# EAGLE design RingShield (EAGLE 9.6.2)
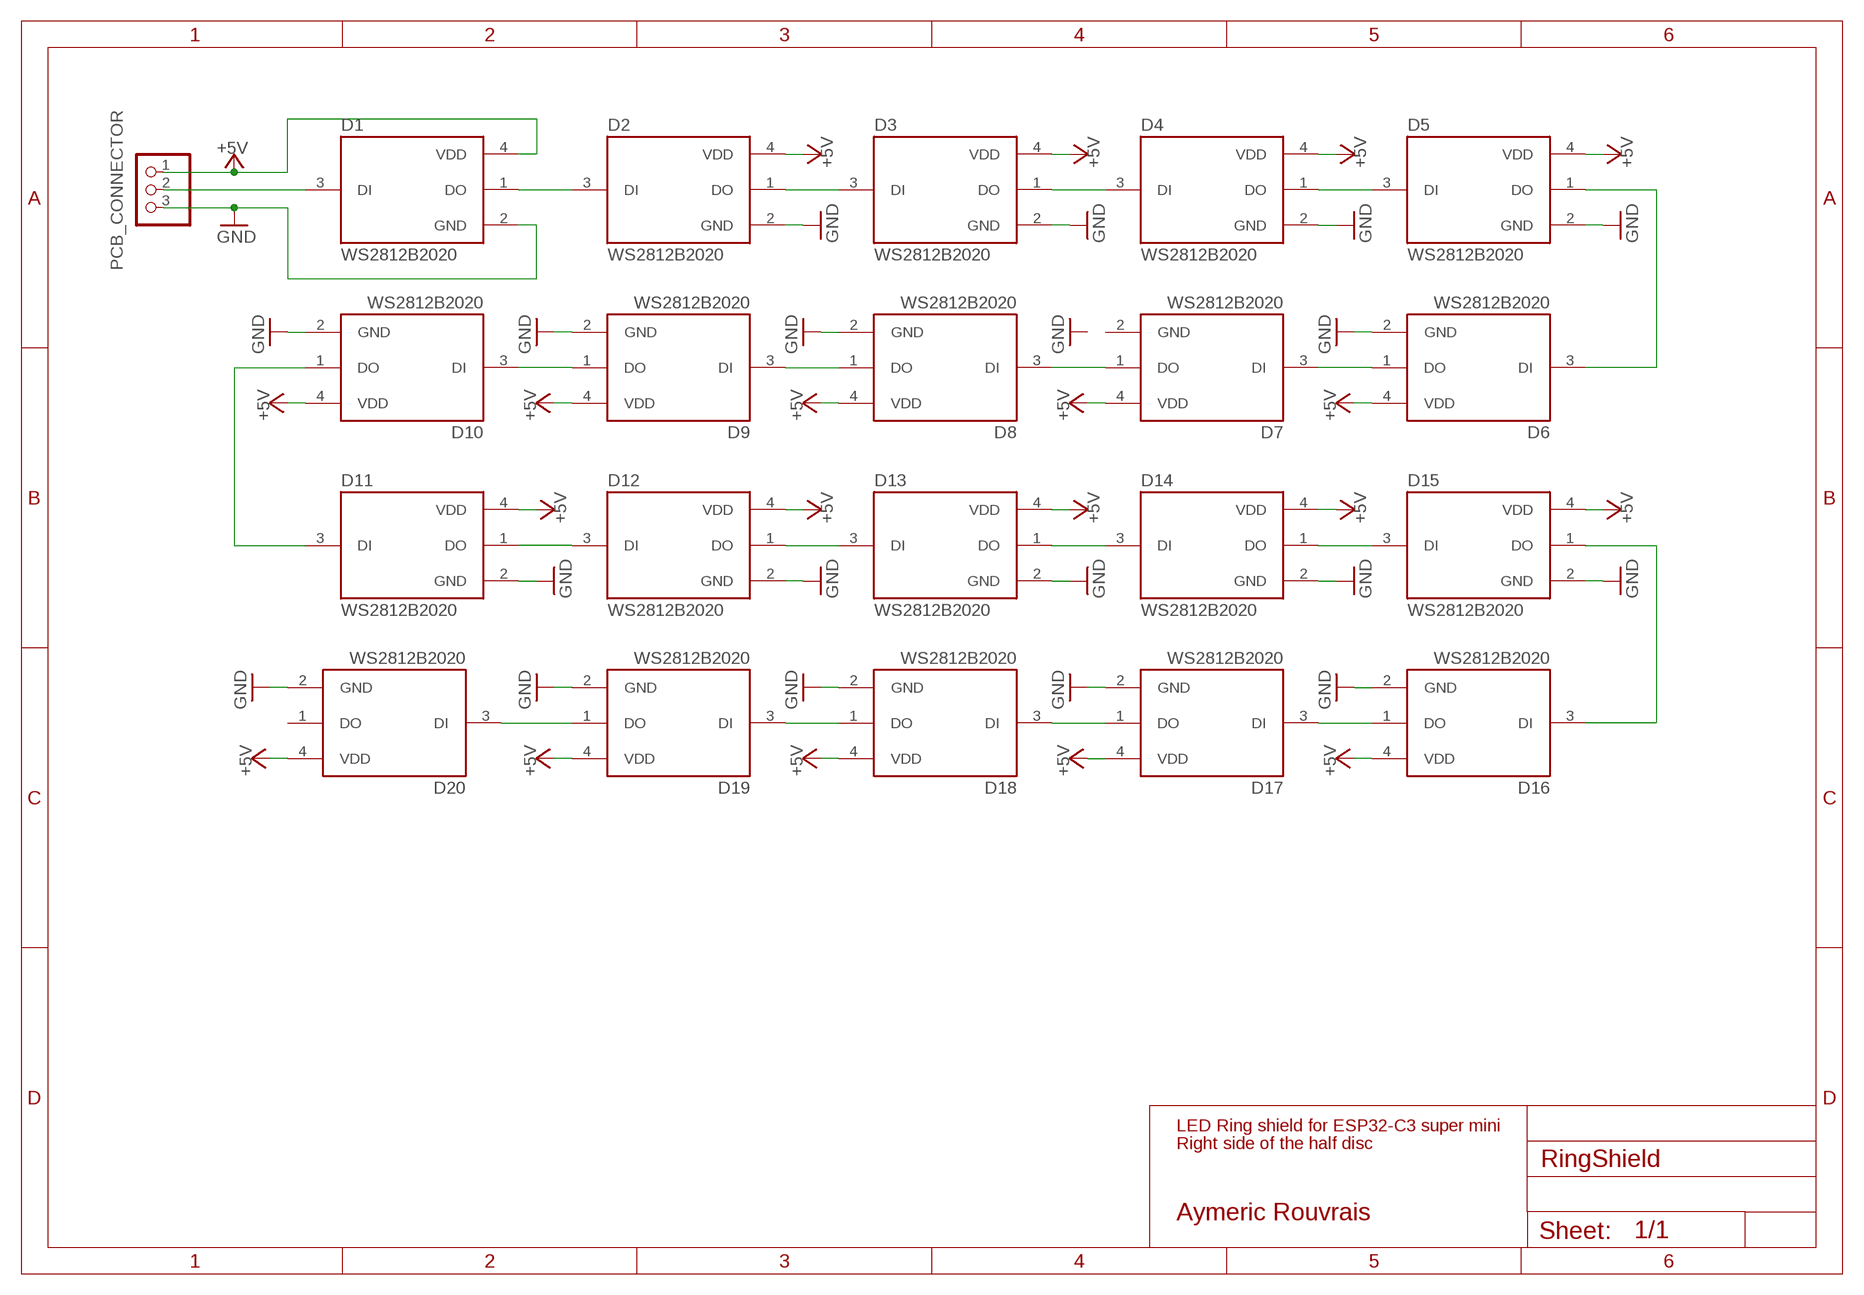
[diagram p0: schematic, sheet 1]

## Parts
D1  WS2812B2020  [LED_WS2812B2020]
D2  WS2812B2020  [LED_WS2812B2020]
D3  WS2812B2020  [LED_WS2812B2020]
D4  WS2812B2020  [LED_WS2812B2020]
D5  WS2812B2020  [LED_WS2812B2020]
D6  WS2812B2020  [LED_WS2812B2020]
D7  WS2812B2020  [LED_WS2812B2020]
D8  WS2812B2020  [LED_WS2812B2020]
D9  WS2812B2020  [LED_WS2812B2020]
D10  WS2812B2020  [LED_WS2812B2020]
D11  WS2812B2020  [LED_WS2812B2020]
D12  WS2812B2020  [LED_WS2812B2020]
D13  WS2812B2020  [LED_WS2812B2020]
D14  WS2812B2020  [LED_WS2812B2020]
D15  WS2812B2020  [LED_WS2812B2020]
D16  WS2812B2020  [LED_WS2812B2020]
D17  WS2812B2020  [LED_WS2812B2020]
D18  WS2812B2020  [LED_WS2812B2020]
D19  WS2812B2020  [LED_WS2812B2020]
D20  WS2812B2020  [LED_WS2812B2020]
PCB_CONNECTOR  PINHD-1X3/90  [1X03/90]

## Nets
+5V: D1.4(VDD) D2.4(VDD) D3.4(VDD) D4.4(VDD) D5.4(VDD) D6.4(VDD) D7.4(VDD) D8.4(VDD) D9.4(VDD) D10.4(VDD) D11.4(VDD) D12.4(VDD) D13.4(VDD) D14.4(VDD) D15.4(VDD) D16.4(VDD) D17.4(VDD) D18.4(VDD) D19.4(VDD) D20.4(VDD) PCB_CONNECTOR.1
GND: D1.2(GND) D2.2(GND) D3.2(GND) D4.2(GND) D5.2(GND) D6.2(GND) D8.2(GND) D9.2(GND) D10.2(GND) D11.2(GND) D12.2(GND) D13.2(GND) D14.2(GND) D15.2(GND) D16.2(GND) D17.2(GND) D18.2(GND) D19.2(GND) D20.2(GND) PCB_CONNECTOR.3
N$1: D1.3(DI) PCB_CONNECTOR.2
N$2: D1.1(DO) D2.3(DI)
N$3: D2.1(DO) D3.3(DI)
N$4: D3.1(DO) D4.3(DI)
N$5: D4.1(DO) D5.3(DI)
N$6: D5.1(DO) D6.3(DI)
N$7: D18.1(DO) D19.3(DI)
N$9: D9.1(DO) D10.3(DI)
N$10: D8.1(DO) D9.3(DI)
N$11: D7.1(DO) D8.3(DI)
N$12: D6.1(DO) D7.3(DI)
N$13: D14.1(DO) D15.3(DI)
N$14: D13.1(DO) D14.3(DI)
N$15: D12.1(DO) D13.3(DI)
N$16: D11.1(DO) D12.3(DI)
N$17: D10.1(DO) D11.3(DI)
N$19: D17.1(DO) D18.3(DI)
N$20: D16.1(DO) D17.3(DI)
N$21: D15.1(DO) D16.3(DI)
N$22: D19.1(DO) D20.3(DI)
Unconnected: D20.1(DO)

## Notes on the sheet
- LED Ring shield for ESP32-C3 super mini
- Right side of the half disc
- Aymeric Rouvrais

## Power pins joined to a net without a drawn wire
GND: D7.2(GND)

## Library data of the parts
D1-D20 = WS2812B2020:WS2812B2020: Check availability <https://pricing.snapeda.com/parts/WS2812B2020/WorldSemi/view-part?ref=eda>; AVAILABILITY: In Stock; CHECK_PRICES: https://www.snapeda.com/parts/WS2812B2020/Worldsemi/view-part/?ref=eda; DESCRIPTION: LED; SMD; 2020; RGB; 2x2x0.84mm; 3.7÷5.3V; Lens: transparent; 2kHz; MF: WorldSemi; MP: WS2812B2020; PACKAGE: None; PRICE: None; SNAPEDA_LINK: https://www.snapeda.com/parts/WS2812B2020/Worldsemi/view-part/?ref=snap
PCB_CONNECTOR = pinhead:PINHD-1X3: PIN HEADER

## Board
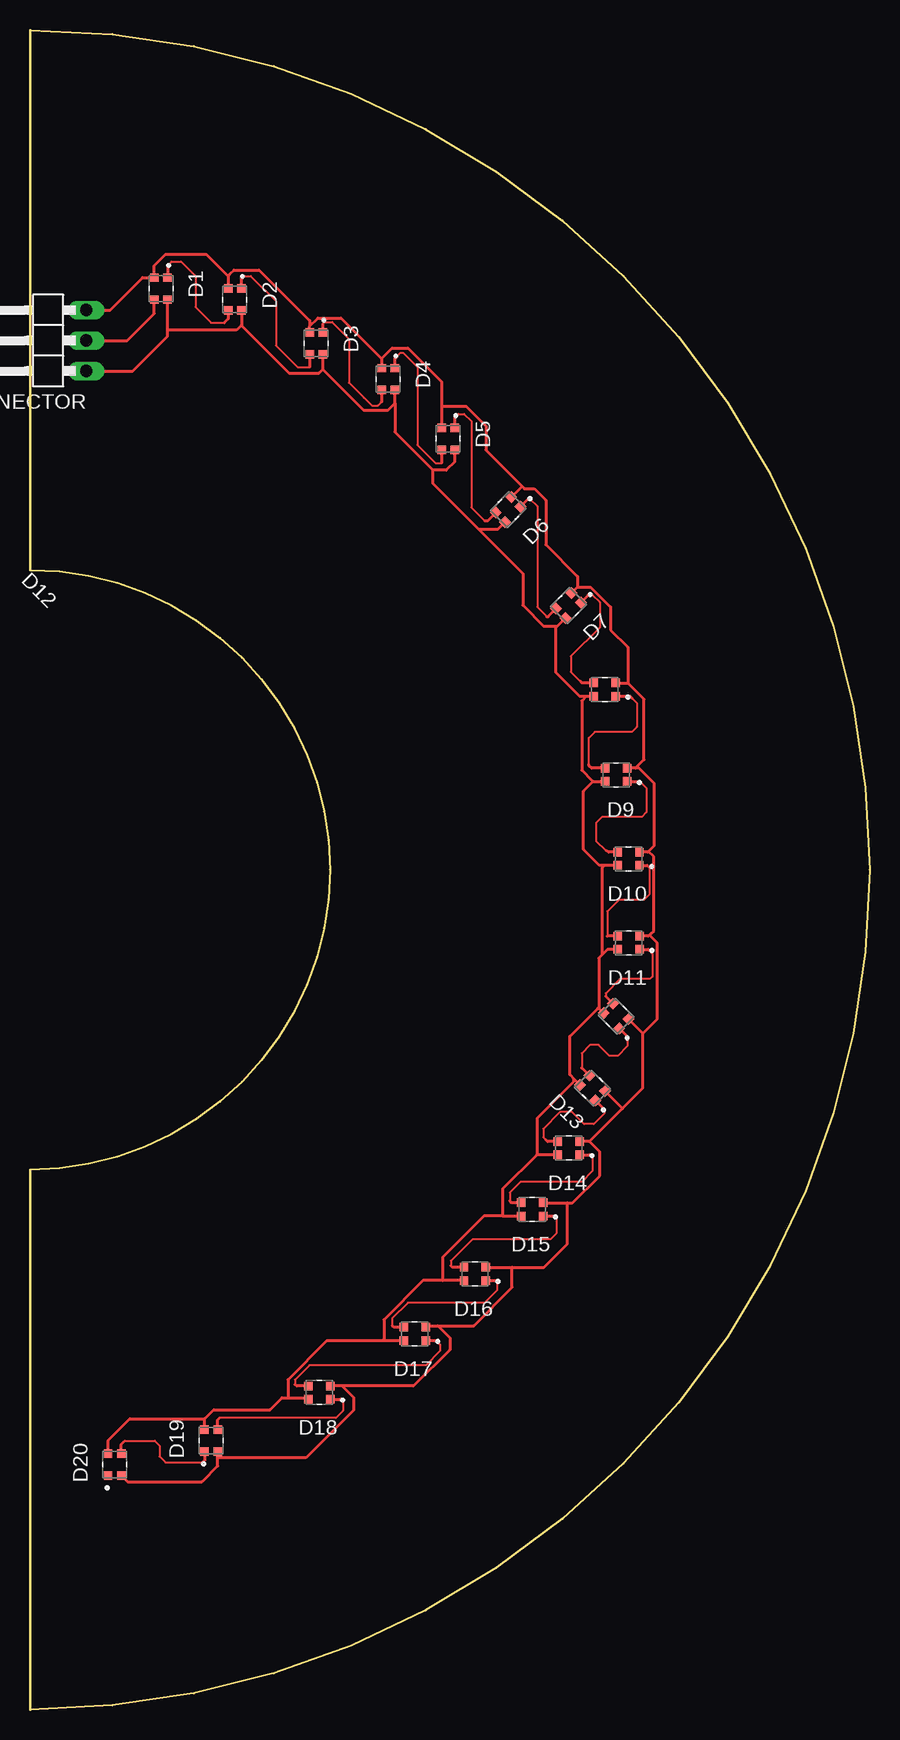
[diagram p1: board, top side]

Size 70 x 140 mm. Coordinates in mm from the lower left corner, seen from the top.
Outline: 0,140 arc-180 0,0 0,45 arc180 0,95 0,140
Copper layers (1*16): Top 0.035mm / dielectric 1.5mm / Bottom 0.035mm
Design rules "default": minimum track width 6mil, minimum drill 0.35mm, track to track 6mil, track to pad 6mil, pad to pad 6mil, via to via 6mil, smd to smd 6mil, copper to edge 40mil, drill to drill 6mil, minimum pad ring 10mil, minimum via ring 8mil, stop-mask expansion 4mil, vias tented up to drill 0mil, thermal gap 10mil

### Footprints (pad centres in the part's own frame; a part is rotated, then mirrored left to right if it is on the bottom)
LED_WS2812B2020 = smd 0.7 x 0.7: 1 -0.915,0.55; 2 -0.915,-0.55; 3 0.915,-0.55; 4 0.915,0.55
1X03/90 = drill 1.016 long: 1 -2.54,-3.81; 2 0,-3.81; 3 2.54,-3.81

### Placement (x,y rotation side)
D1  10.92,118.44 270 top
D2  17.08,117.53 270 top
D3  23.87,113.87 270 top
D4  29.87,110.9 270 top
D5  34.87,105.93 270 top
D6  39.87,100.02 225 top
D7  44.9,92.02 225 top
D8  47.93,85.02 180 top
D9  48.87,77.91 180 top
D10  49.9,70.91 180 top
D11  49.93,63.91 180 top
D12  48.87,57.8 135 top
D13  46.9,51.8 135 top
D14  44.93,46.8 180 top
D15  41.87,41.69 180 top
D16  37.1,36.31 180 top
D17  32.07,31.31 180 top
D18  24.13,26.42 180 top
D19  15.1,22.42 90 top
D20  7.07,20.42 90 top
PCB_CONNECTOR  0.88,114.12 90 top

### Tracks (layer width: path | path; a pad name or v marks a point on that pad's centre or on a via)
+5V
  Top 0.24: PCB_CONNECTOR.1 8.58,111.58 11.47,114.47 11.47,115 | 11.47,115 D1.4 | 17.63,115.42 17.21,115 11.47,115 | 24.42,111.72 D3.4 | 30.42,108.89 29.84,108.3 27.82,108.3 24.42,111.7 24.42,111.72 | 30.42,108.89 D4.4 | 33.6,103.3 34.7,103.3 35.42,104.02 D5.4 | 33.6,103.3 30.42,106.48 30.42,108.89 | 37.42,98.38 39.01,98.38 D6.4 | 37.42,98.38 41.1,94.7 41.1,92.05 42.86,90.28 43.94,90.28 | 43.94,90.28 D7.4 | 46.41,84.47 45.81,84.47 43.84,86.44 43.84,90.18 43.94,90.28 | 46.41,84.47 D8.4 | 46.41,84.47 46.02,84.07 46.02,78.3 46.95,77.36 | 46.95,77.36 D9.4 | D10.4 47.9,70.36 | 47.9,70.36 47.48,70.36 46.16,71.69 46.16,76.56 46.95,77.36 | 47.43,58.46 47.43,62.63 47.7,62.9 | 47.43,58.46 D12.4 | D11.4 48.16,63.36 47.7,62.9 | 45.36,52.56 45,52.92 45,56.12 47.33,58.46 47.43,58.46 | 45.36,52.56 D13.4 | 42.3,46.25 42.25,46.25 39.4,43.4 39.4,41.14 | 39.4,41.14 37.84,41.14 34.4,37.7 34.4,35.76 | D16.4 34.4,35.76 | 34.4,35.76 32.76,35.76 29.5,32.5 29.5,30.86 29.6,30.76 | 29.6,30.76 24.76,30.76 21.5,27.5 21.5,26 | 29.6,30.76 D17.4 | D19.4 14.55,24.23 | 14.55,24.23 15.31,25 20,25 21,26 21.5,26 | D18.4 23.09,26 21.5,26 | D2.4 17.63,115.42 | 17.63,115.42 17.63,115.37 21.6,111.4 24.1,111.4 24.42,111.72 | 33.6,103.3 33.6,102.2 37.42,98.38 | 47.9,70.36 47.7,70.16 47.7,62.9 | 42.3,46.25 42.3,49.3 45.36,52.36 45.36,52.56 | 39.4,41.14 D15.4 | 14.55,24.23 8.32,24.23 6.52,22.43 D20.4 | D14.4 42.3,46.25
GND
  Top 0.16: 16.45,119.55 16.53,119.47 | 16.65,119.65 16.65,119.59
  Top 0.24: PCB_CONNECTOR.3 6.69,116.66 9.38,119.36 D1.2 10.37,120.37 11.3,121.3 14.7,121.3 16.45,119.55 | D2.2 16.53,119.47 16.53,119.53 16.65,119.65 17,120 19.1,120 23.32,115.78 23.32,115.32 | D20.2 8.12,19 14.35,19 15.65,20.3 15.65,21.1 | 15.65,21.1 D19.2 | D3.2 23.32,115.32 | 23.32,115.32 24,116 25.93,116 29.32,112.61 | 29.32,112.61 D4.2 | 29.32,112.61 30.2,113.5 31.5,113.5 34.32,110.68 34.32,108.6 | D8.2 49.84,85.57 | 45.66,93.56 46.74,93.56 48.4,91.9 48.4,90 49.84,88.56 49.84,85.57 | 45.66,93.56 D7.2 | 50.48,78.46 51.2,79.17 51.2,84.22 49.84,85.57 | 50.48,78.46 D9.2 | 51.58,71.52 52.02,71.96 52.02,77.23 50.78,78.46 50.48,78.46 | 51.58,71.52 51.52,71.46 D10.2 | 44.8,42.24 45.24,42.24 47.5,44.5 47.5,46.49 46.65,47.35 | D17.2 33.12,32 34,32 | 34,32 37,32 40.2,35.2 40.2,36.86 | 34,32 35,31 35,30 31.97,26.97 D18.2 26.03,26.97 27,26 27,25 23,21 15.75,21 15.65,21.1 | 34.32,108.6 D5.2 | 34.32,108.6 36.4,108.6 38,107 38,104.98 41.04,101.94 | 41.04,101.94 41.23,101.76 42.04,101.76 43,100.8 43,97.1 45.66,94.44 45.66,93.56 | D6.2 41.01,101.94 41.04,101.94 | 51.58,71.52 52,71.1 52,64.92 51.74,64.66 | 51.74,64.66 51.74,64.46 52.3,63.91 52.3,57.55 51.1,56.35 | 51.74,64.66 51.55,64.46 D11.2 | 49.4,50.1 51.1,51.8 51.1,56.35 | 51.1,56.35 D12.2 | 49.4,50.1 49.38,50.1 D13.2 | 49.4,50.1 46.65,47.35 | 46.65,47.35 D14.2 | 44.8,42.24 44.8,38.8 42.86,36.86 40.2,36.86 | D16.2 40.2,36.86 | D15.2 44.8,42.24
N$1
  Top 0.24: PCB_CONNECTOR.2 8.12,114.12 10.37,116.37 D1.3
N$2
  Top 0.16: 11.5,120.2 11.5,120.4 11.8,120.7 12.6,120.7 13.8,119.5 13.8,116.9 15.1,115.6 16.2,115.6
  Top 0.24: D1.1 11.5,119.39 11.5,120.2 | D2.3 16.53,115.93 16.2,115.6
N$3
  Top 0.16: 17.7,119.3 17.9,119.5 18.4,119.5 20.5,117.4 20.5,113.7 22.3,111.9 23.3,111.9
  Top 0.24: D2.1 17.63,119.23 17.7,119.3 | D3.3 23.32,111.92 23.3,111.9
N$4
  Top 0.16: 24.42,115.52 24.55,115.65 25.2,115.65 26.6,114.25 26.6,110.6 27.85,109.35 27.9,109.3 28.5,108.7 29,108.7 29.3,109
  Top 0.24: D3.1 24.42,115.52 | D4.3 29.32,109.02 29.3,109
N$5
  Top 0.16: 30.6,112.8 30.9,113.1 31.1,113.1 32.3,111.9 32.3,105.4 33.8,103.9 34.3,103.9
  Top 0.24: D4.1 30.42,112.62 30.6,112.8 | D5.3 34.32,103.92 34.3,103.9
N$6
  Top 0.16: 35.6,107.9 35.7,108 36.2,108 36.8,107.4 36.8,100.2 37.9,99.1
  Top 0.24: D5.1 35.42,107.72 35.6,107.9 | D6.3 38.17,99.1 37.9,99.1
N$7
  Top 0.16: 26.1,25.7 26.1,24.9 25.5,24.3 15.8,24.3
  Top 0.24: D18.1 25.93,25.87 26.1,25.7 | D19.3 15.65,24.15 15.8,24.3
N$9
  Top 0.16: 50.84,77.36 51.4,76.8 51.4,74.8 51,74.4 47.7,74.4 47.2,73.9 47.2,72.4 48,71.6 48.1,71.6
  Top 0.24: D9.1 50.84,77.36 | D10.3 48.24,71.46 48.1,71.6
N$10
  Top 0.16: 50.2,84.3 50.6,83.9 50.6,81.9 50.2,81.5 47.1,81.5 46.6,81 46.6,78.8
  Top 0.24: D8.1 50.03,84.47 50.2,84.3 | D9.3 46.84,78.46 46.6,78.7 46.6,78.8
N$11
  Top 0.16: 45.9,85.7 45.1,86.5 45.1,87.8 47.5,90.2 47.5,92.3 46.9,92.9 46.56,92.9
  Top 0.24: D8.3 46.03,85.57 45.9,85.7 | D7.1 46.56,92.9
N$12
  Top 0.16: 41.7,100.9 42.3,100.3 42.3,91.9 43.1,91.1
  Top 0.24: D6.1 41.53,100.9 41.7,100.9 | D7.3 43.2,91.1 43.1,91.1
N$13
  Top 0.16: 46.8,46.1 46.9,46 46.9,44.9 46,44 40.9,44 40,43.1 40,42.4
  Top 0.24: D14.1 46.65,46.25 46.8,46.1 | D15.3 40.16,42.24 40,42.4
N$14
  Top 0.16: 47.16,50.49 D13.1 | 47.9,49.9 47.9,49.7 47,48.8 46.2,48.8 45.2,49.8 44.2,49.8 42.8,48.4 42.8,47.7 43,47.5
  Top 0.24: D13.1 47.9,50.02 47.9,49.9 | D14.3 43.15,47.35 43,47.5
N$15
  Top 0.16: 49.8,55.8 49.8,55.3 49,54.5 48.3,54.5 47.4,55.4 46.7,55.4 46,54.7 46,53.5
  Top 0.24: D12.1 49.8,56.09 49.8,55.8 | D13.3 46,53.48 46,53.5
N$16
  Top 0.16: 51.54,63.36 51.6,63.3 51.9,63 51.9,61.1 51.7,60.9 49.2,60.9 48,59.7 48,59.45
  Top 0.24: D11.1 51.54,63.36 51.6,63.3 | D12.3 48,59.45
N$17
  Top 0.16: 51.44,70.36 51.65,70.15 51.65,67.95 51.2,67.5 49.1,67.5 48.14,66.54 48.14,64.46
  Top 0.24: D10.1 51.44,70.36 | D11.3 48.14,64.46
N$19
  Top 0.16: 34,30.6 34.2,30.4 34.2,29.9 33,28.7 23.3,28.7 22.1,27.5 22.1,27.1
  Top 0.24: D17.1 33.84,30.76 34,30.6 | D18.3 22.23,26.97 22.1,27.1
N$20
  Top 0.16: 38.94,35.76 38.94,34.94 37.9,33.9 31.5,33.9 30.2,32.6 30.2,32
  Top 0.24: D16.1 38.94,35.76 | D17.3 30.34,31.86 30.2,32
N$21
  Top 0.16: 43.9,41 43.9,39.7 43.4,39.2 36.9,39.2 35.1,37.4 35.1,37
  Top 0.24: D15.1 43.76,41.14 43.9,41 | D16.3 35.24,36.86 35.1,37
N$22
  Top 0.16: 7.8,22.3 7.9,22.4 10.4,22.4 10.8,22 10.8,21.1 11.3,20.6 14.4,20.6
  Top 0.24: D19.1 14.55,20.75 14.4,20.6 | D20.3 7.62,22.12 7.8,22.3